# EAGLE design rapidshark-main-breakout-top-mk-1.D (EAGLE 7.5.0)
AUTHOR: sean@yak.net
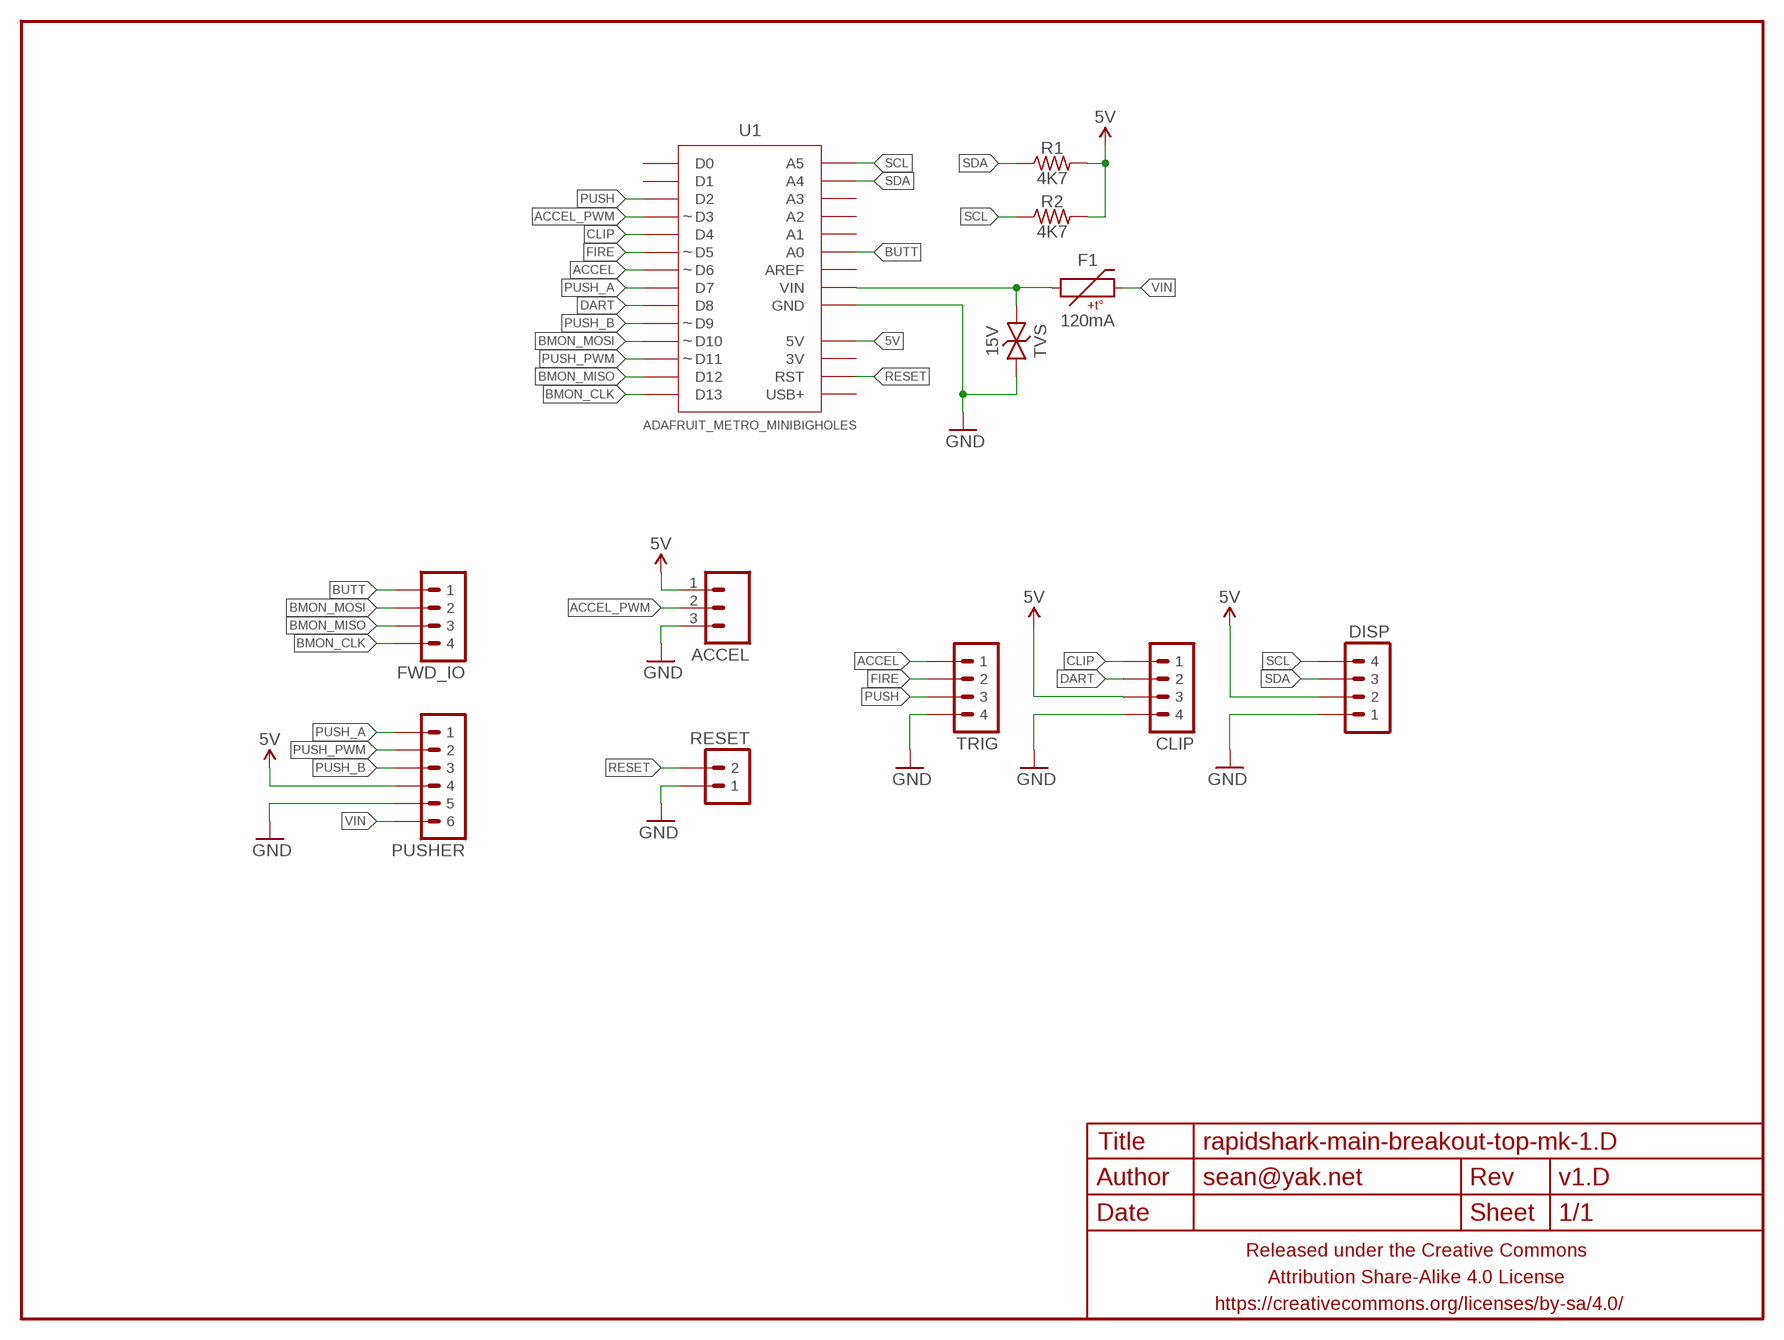
[diagram p0: schematic, sheet 1]

## Parts
ACCEL  M03JST-PTH-VERT-CENTERED  [JST-3-PH-VERT-PTH-CENTERED]
CLIP  M04JST-PTH-VERT  [JST-4-PH-VERT-PTH]
DISP  M04JST-PTH-VERT  [JST-4-PH-VERT-PTH]
F1  120mA  PTCSMD  [PTC-1206]
FRAME1  FRAME-LETTERNO_PACKAGE  [DUMMY]
FWD_IO  M04JST-PTH-VERT  [JST-4-PH-VERT-PTH]
PUSHER  M06JST-PH-PTH-VERT  [JST-6-PH-VERT-PTH]
R1  4K7  RESISTORR0603-TIGHTER  [R0603-TIGHTER]
R2  4K7  RESISTORR0603-TIGHTER  [R0603-TIGHTER]
RESET  M02JST-PTH-VERT  [JST-2-PH-VERT-PTH]
TRIG  M04JST-PTH-VERT  [JST-4-PH-VERT-PTH]
TVS  15V  TVSSMA  [SMA-DIODE-TVS-BIDIR]
U1  ADAFRUIT_METRO_MINIBIGHOLES  [ADAFRUIT_METRO_MINI_BIGHOLES]

## Nets
5V: ACCEL.1 CLIP.3 DISP.2 PUSHER.4 R1.2 R2.2 U1.18(5V)
ACCEL: TRIG.1 U1.7(D6)
ACCEL_PWM: ACCEL.2 U1.4(D3)
BMON_CLK: FWD_IO.4 U1.14(D13)
BMON_MISO: FWD_IO.3 U1.13(D12)
BMON_MOSI: FWD_IO.2 U1.11(D10)
BUTT: FWD_IO.1 U1.23(A0)
CLIP: CLIP.1 U1.5(D4)
DART: CLIP.2 U1.9(D8)
FIRE: TRIG.2 U1.6(D5)
GND: ACCEL.3 CLIP.4 DISP.1 PUSHER.5 RESET.1 TRIG.4 TVS.1 U1.19(GND) U1.20(GND)
N$1: F1.1 TVS.2 U1.21(VIN)
PUSH: TRIG.3 U1.3(D2)
PUSH_A: PUSHER.1 U1.8(D7)
PUSH_B: PUSHER.3 U1.10(D9)
PUSH_PWM: PUSHER.2 U1.12(D11)
RESET: RESET.2 U1.16(RST)
SCL: DISP.4 R2.1 U1.28(A5)
SDA: DISP.3 R1.1 U1.27(A4)
VIN: F1.2 PUSHER.6
Unconnected: U1.1(D0) U1.2(D1) U1.15(USB+) U1.17(3V) U1.22(AREF) U1.24(A1) U1.25(A2) U1.26(A3)

## Library data of the parts
ACCEL = a_parts:M03: Header 3 Standard 3-pin 0.1" header. Use with straight break away headers (SKU : PRT-00116), right angle break away headers (PRT-00553), swiss pins (PRT-00743), machine pins (PRT-00117), and female headers (PRT-00115). Molex polarized connector foot print use with SKU : PRT-08232 with associated crimp pins and housings.
CLIP DISP FWD_IO TRIG = a_parts:M04: Header 4 Standard 4-pin 0.1" header. Use with straight break away headers (SKU : PRT-00116), right angle break away headers (PRT-00553), swiss pins (PRT-00743), machine pins (PRT-00117), and female headers (PRT-00115). Molex polarized connector foot print use with SKU : PRT-08231 with associated crimp pins and housings. 1MM SMD Version SKU: PRT-10208
F1 = a_parts:PTC: Resettable Fuse PTC Resettable Fuse. Spark Fun Electronics SKU : COM-08357; PROD_ID: RES-11150
FRAME1 = a_parts:FRAME-LETTER: Schematic Frame Standard 8.5x11 US Letter frame; DESIGNER: sean@yak.net; VERSION: v1.D
PUSHER = a_parts:M06: Header 6 Standard 6-pin 0.1" header. Use with straight break away headers (SKU : PRT-00116), right angle break away headers (PRT-00553), swiss pins (PRT-00743), machine pins (PRT-00117), and female headers (PRT-00115). Molex polarized connector foot print use with SKU : PRT-08094 with associated crimp pins and housings. NOTES ON THE VARIANTS LOCK and LOCK_LONGPADS... This footprint was designed to help hold the alignment of a through-hole component (i.e. 6-pin header) while soldering it into place. You may notice that each hole has been shifted either up or down by 0.005 of an inch from it's more standard position (which is a perfectly straight line). This slight alteration caused the pins (the squares in the middle) to touch the edges of the holes. Because they are alternating, it causes a "brace" to hold the component in place. 0.005 has proven to be the perfect amount of "off-center" position when using our standard breakaway headers. Although looks a little odd when you look at the bare footprint, once you have a header in there, the alteration is very hard to notice. Also,if you push a header all the way into place, it is covered up entirely on the bottom side. This idea of altering the position of holes to aid alignment will be further integrated into the Sparkfun Library for other footprints. It can help hold any component with 3 or more connection pins.
R1 R2 = a_parts:RESISTOR: RESISTOR, American symbol
RESET = a_parts:M02: Standard 2-pin 0.1" header. Use with - straight break away headers ( PRT-00116) - right angle break away headers (PRT-00553) - swiss pins (PRT-00743) - machine pins (PRT-00117) - female headers (PRT-00115) Molex polarized connector foot print use with: PRT-08233 with associated crimp pins and housings. 2.54_SCREWTERM for use with PRT-10571. 3.5mm Screw Terminal footprints for PRT-08084 5mm Screw Terminal footprints for use with PRT-08433
TVS = a_parts:TVS: Transient voltage suppressor- prevents ESD on inputs. Ignore package description- MBRA140 is NOT this type of part!!!
U1 = a_parts:ADAFRUIT_METRO_MINI

## Board
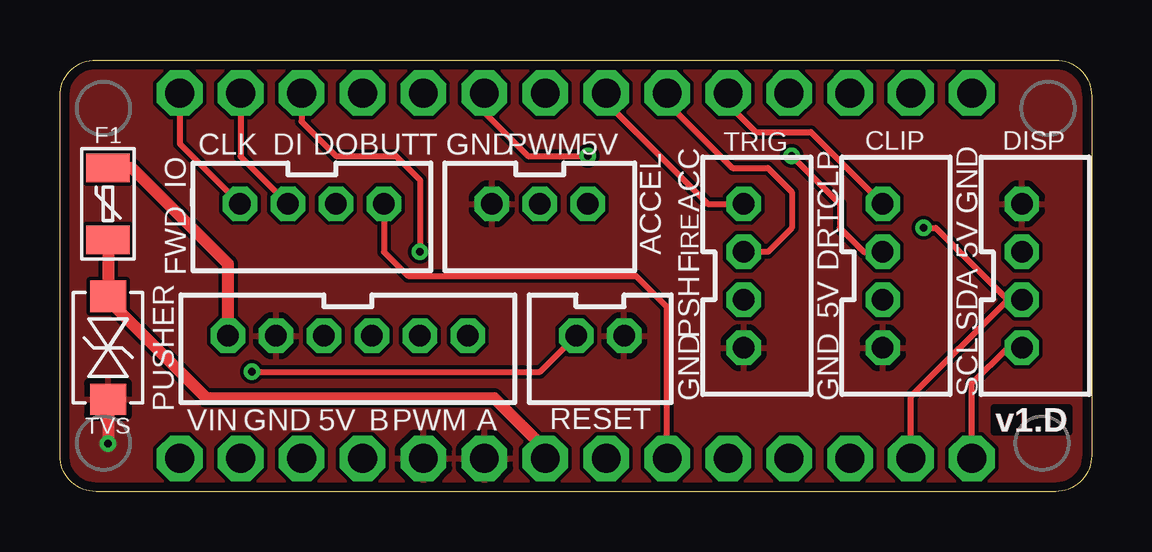
[diagram p1: board, top side]
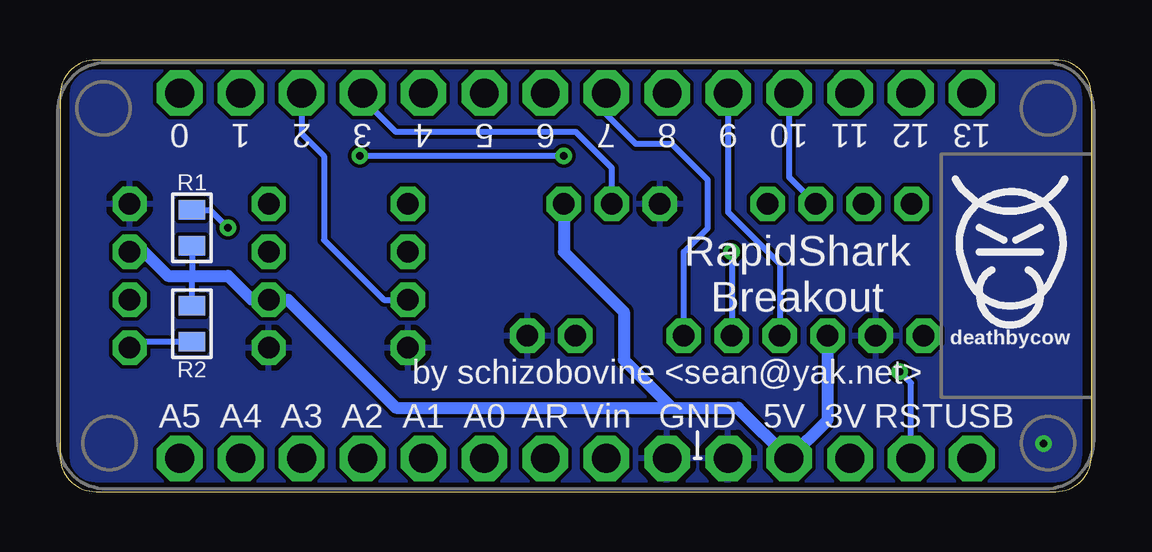
[diagram p2: board, bottom side, seen from below]

Size 43 x 18 mm. Coordinates in mm from the lower left corner, seen from the top.
Outline: 1.5,18 41.5,18 arc-90 43,16.5 43,1.5 arc-90 41.5,0 1.5,0 arc-90 0,1.5 0,16.5 arc-90 1.5,18
Copper layers (1*16): Top 0.0356mm / dielectric 1.5011mm / Bottom 0.0356mm
Design rules "LaenPCBOrder_2": minimum track width 6mil, minimum drill 13mil, track to track 6mil, track to pad 6mil, pad to pad 6mil, via to via 6mil, smd to smd 6mil, copper to edge 15mil, drill to drill 6mil, minimum pad ring 7mil, minimum via ring 7mil, stop-mask expansion 3mil, vias tented up to drill 20mil, thermal gap 10mil

### Footprints (pad centres in the part's own frame; a part is rotated, then mirrored left to right if it is on the bottom)
JST-3-PH-VERT-PTH-CENTERED = drill 0.9 pad 1.422 octagon: 1 -2,0; 2 0,0; 3 2,0
JST-4-PH-VERT-PTH = drill 0.9 pad 1.422 octagon: 1 0,0; 2 2,0; 3 4,0; 4 6,0
PTC-1206 = smd 1.2 x 1.8: 1 -1.5,0; 2 1.5,0
JST-6-PH-VERT-PTH = drill 0.9 pad 1.422 octagon: 1 -5,0; 2 -3,0; 3 -1,0; 4 1,0; 5 3,0; 6 5,0
R0603-TIGHTER = smd 0.8 x 1.1: 1 -0.75,0; 2 0.75,0
JST-2-PH-VERT-PTH = drill 0.9 pad 1.422 octagon: 1 -1,0; 2 1,0
SMA-DIODE-TVS-BIDIR = smd 1.3 x 1.5: 1 -2.15,0; 2 2.15,0
ADAFRUIT_METRO_MINI_BIGHOLES = drill 1.2 pad 1.9 octagon: 1 16.51,7.62; 2 13.97,7.62; 3 11.43,7.62; 4 8.89,7.62; 5 6.35,7.62; 6 3.81,7.62; 7 1.27,7.62; 8 -1.27,7.62; 9 -3.81,7.62; 10 -6.35,7.62; 11 -8.89,7.62; 12 -11.43,7.62; 13 -13.97,7.62; 14 -16.51,7.62; 15 -16.51,-7.62; 16 -13.97,-7.62; 17 -11.43,-7.62; 18 -8.89,-7.62; 19 -6.35,-7.62; 20 -3.81,-7.62; 21 -1.27,-7.62; 22 1.27,-7.62; 23 3.81,-7.62; 24 6.35,-7.62; 25 8.89,-7.62; 26 11.43,-7.62; 27 13.97,-7.62; 28 16.51,-7.62

### Placement (x,y rotation side)
ACCEL  20,12 180 top
CLIP  34.3,12 270 top
DISP  40.1,12 270 top
F1  2,12 90 top
FRAME1  0,0 270 bottom
FWD_IO  13.5,12 180 top
PUSHER  12,6.5 180 top
R1  37.5,11 270 bottom
R2  37.5,7 90 bottom
RESET  22.52,6.5 180 top
TRIG  28.5,12 270 top
TVS  2,6 90 top
U1  21.5,9 0 top
U$2  [COW_SMALL]  3.4,10.5 0 bottom

### Tracks (layer width: path | path; a pad name or v marks a point on that pad's centre or on a via)
5V
  Bottom 0.254: R2.2 37.5,9 R1.2
  Bottom 0.5: PUSHER.4 11,2.99 U1.18 14.73,3.5 17.5,3.5 | DISP.2 39.5,10 38.5,9 37.5,9 36,9 35,8 CLIP.3 33.5,8 29,3.5 17.5,3.5 | ACCEL.1 22,10 19.5,7.5 19.5,5.5 17.5,3.5
ACCEL
  Top 0.254: U1.7 22.77,16.23 27,12 TRIG.1
ACCEL_PWM
  Bottom 0.254: ACCEL.2 20,13.5 21.5,15 29,15 30.39,16.39 U1.4
BMON_CLK
  Top 0.254: U1.14 4.99,14.51 FWD_IO.4
BMON_MISO
  Top 0.254: U1.13 7.53,13.97 FWD_IO.3
BMON_MOSI
  Bottom 0.254: U1.11 12.61,13.11 FWD_IO.2
BUTT
  Top 0.254: FWD_IO.1 13.5,10 14.5,9 24,9 25.31,7.69 U1.23
CLIP
  Top 0.254: U1.5 27.85,16.15 29,15 31.3,15 CLIP.1
DART  (via drill 0.33)
  Top 0.254: U1.9 17.69,15.81 19.5,14 v22,14 | v30.5,14 32.5,12 32.5,11 33.5,10 CLIP.2
  Bottom 0.254: v22,14 v30.5,14
FIRE
  Top 0.254: TRIG.2 29.5,10 30.5,11 30.5,12.5 29.5,13.5 28.03,13.5 25.31,16.22 U1.6
GND  (via drill 0.33)
  Top 0.5: TVS.1 v2,2
  pour Bottom (rank 6): 1.5,18 41.5,18 arc-90 43,16.5 43,1.5 arc-90 41.5,0 1.5,0 arc-90 0,1.5 0,16.5 arc-90
  pour Top (rank 6): 1.5,18 41.5,18 arc-90 43,16.5 43,1.5 arc-90 41.5,0 1.5,0 arc-90 0,1.5 0,16.5 arc-90
N$1
  Top 0.5: F1.1 TVS.2 2,8 6.1,3.9 18.1,3.9 20.23,1.77 U1.21
PUSH
  Bottom 0.254: U1.3 32.93,14.93 32,14 32,10.5 29.5,8 TRIG.3
PUSH_A
  Bottom 0.254: PUSHER.1 17,10 16,11 16,13 17.5,14.5 19,14.5 20.23,15.73 U1.8
PUSH_B
  Bottom 0.254: U1.10 15.15,11.65 13,9.5 PUSHER.3
PUSH_PWM  (via drill 0.33)
  Top 0.254: U1.12 10.07,15.43 11.5,14 14,14 15,13 v15,10
  Bottom 0.254: v15,10 PUSHER.2
RESET  (via drill 0.33)
  Top 0.254: v8,5 20.02,5 RESET.2
  Bottom 0.254: U1.16 7.53,4.53 v8,5
SCL
  Top 0.254: U1.28 38.01,4.51 39.5,6 DISP.4
  Bottom 0.254: R2.1 39.85,6.25 DISP.4
SDA  (via drill 0.33)
  Top 0.254: U1.27 35.47,3.97 39.5,8 | 39.5,8 DISP.3 | v36,11 36.5,11 39.5,8
  Bottom 0.254: R1.1 36.75,11.75 v36,11
VIN
  Top 0.5: PUSHER.6 7,9.5 3,13.5 F1.2

### Text on the board
tPlace: CLK | DI | DO | BUTT | GND | PWM | 5V | ACC | CLP | GND | IRE | F | DRT | 5V | PSH | 5V | SDA | GND | GND | SCL | VIN | GND | 5V | B | PWM | A
bPlace: RapidShark / Breakout | by schizobovine <sean@yak.net>